# EAGLE schematic board (EAGLE 6.3)
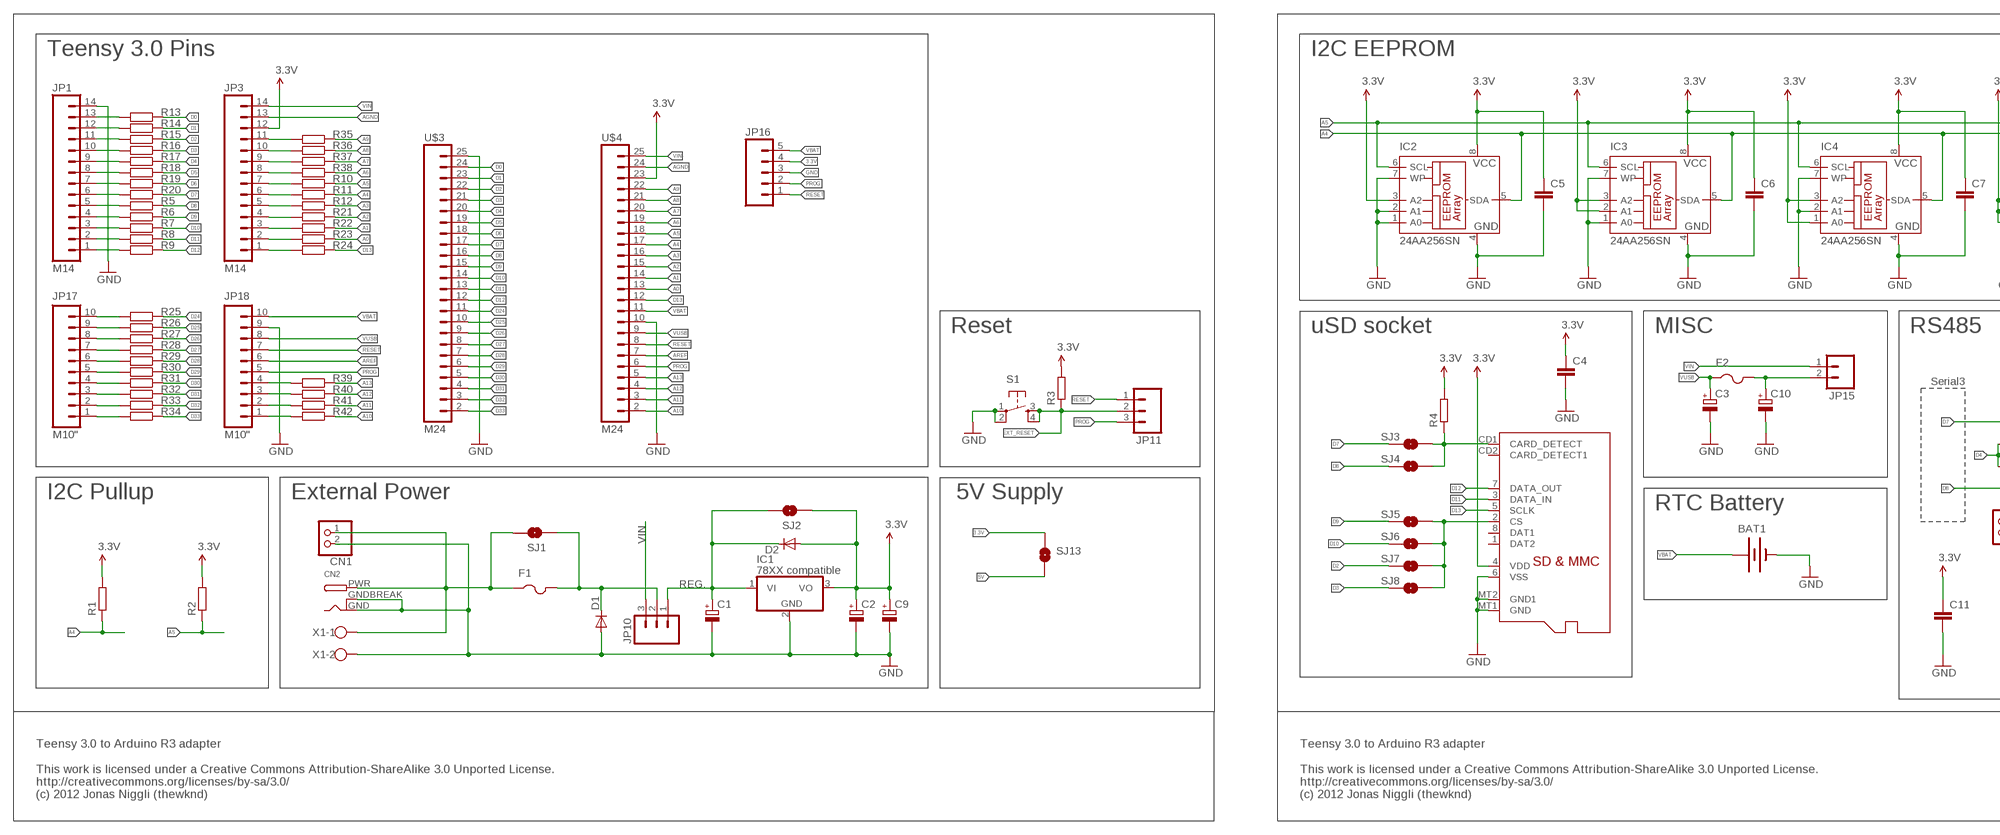
[diagram p0: schematic, sheet 1, part 1 of 2]
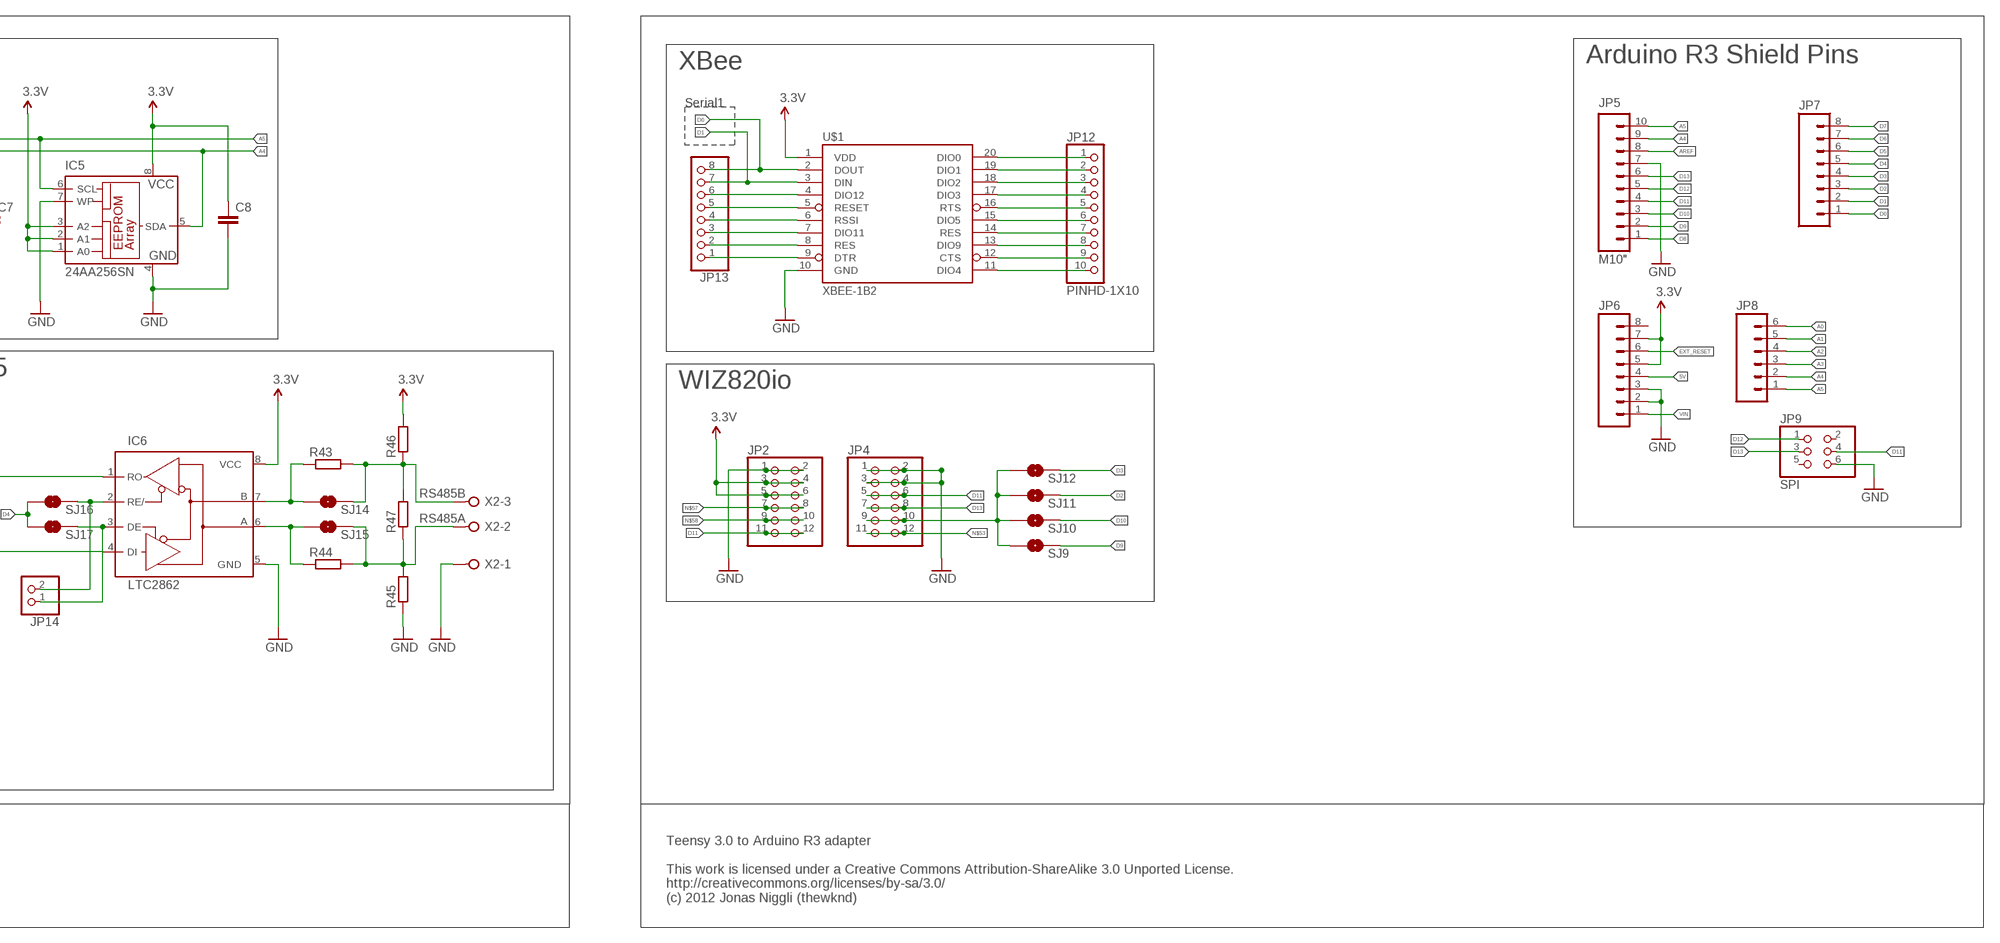
[diagram p1: schematic, sheet 1, part 2 of 2]

## Parts
BAT1  BATTERY12MM  [BATTCON_12MM]
C1  CPOL-EUCT3216  [CT3216]
C2  CPOL-EUCT3216  [CT3216]
C3  CPOL-EUCT3528  [CT3528]
C4  C-EUC0805K  [C0805K]
C5  C-EUC0805K  [C0805K]
C6  C-EUC0805K  [C0805K]
C7  C-EUC0805K  [C0805K]
C8  C-EUC0805K  [C0805K]
C9  CPOL-EUD  [PANASONIC_D]
C10  CPOL-EU085CS-1AR  [085CS_1AR]
C11  C-EUC0805K  [C0805K]
CN1  JST_2PIN-THM-RA  [JST-PH-2-THM-RA]
CN2  DCBARRELPTH  [DCJACK_2MM_PTH]
D1  DIODESMA-KIT  [SMA-DIODE-KIT]
D2  DIODESMA-KIT  [SMA-DIODE-KIT]
F1  PTCFUSE-1812  [1812]
F2  PTCFUSE-1812  [1812]
IC1  78XX compatible  7805TV  [TO220V]
IC2  24AA256SN  [SO-08]
IC3  24AA256SN  [SO-08]
IC4  24AA256SN  [SO-08]
IC5  24AA256SN  [SO-08]
IC6  LTC2862  MAX3468ESA  [SO08]
JP1  M14  [1X14]
JP2  PINHD-2X6  [2X06]
JP3  M14  [1X14]
JP4  PINHD-2X6  [2X06]
JP5  M10"  [1X10]
JP6  M081X08  [1X08]
JP7  M081X08  [1X08]
JP8  M06SIP  [1X06]
JP9  SPI  PINHD-2X3  [2X03]
JP10  M03PTH  [1X03]
JP11  M03PTH  [1X03]
JP12  PINHD-1X10  [1X10-BIG]
JP13  PINHD-1X8BIG  [1X08-BIG]
JP14  PINHD-1X2  [1X02]
JP15  M02PTH  [1X02]
JP16  M05PTH  [1X05]
JP17  M10"  [1X10]
JP18  M10"  [1X10]
R1  R-EU_R0805  [R0805]
R2  R-EU_R0805  [R0805]
R3  R-EU_R0805  [R0805]
R4  R-EU_R0805  [R0805]
R5  R-EU_R0805  [R0805]
R6  R-EU_R0805  [R0805]
R7  R-EU_R0805  [R0805]
R8  R-EU_R0805  [R0805]
R9  R-EU_R0805  [R0805]
R10  R-EU_R0805  [R0805]
R11  R-EU_R0805  [R0805]
R12  R-EU_R0805  [R0805]
R13  R-EU_R0805  [R0805]
R14  R-EU_R0805  [R0805]
R15  R-EU_R0805  [R0805]
R16  R-EU_R0805  [R0805]
R17  R-EU_R0805  [R0805]
R18  R-EU_R0805  [R0805]
R19  R-EU_R0805  [R0805]
R20  R-EU_R0805  [R0805]
R21  R-EU_R0805  [R0805]
R22  R-EU_R0805  [R0805]
R23  R-EU_R0805  [R0805]
R24  R-EU_R0805  [R0805]
R25  R-EU_R0805  [R0805]
R26  R-EU_R0805  [R0805]
R27  R-EU_R0805  [R0805]
R28  R-EU_R0805  [R0805]
R29  R-EU_R0805  [R0805]
R30  R-EU_R0805  [R0805]
R31  R-EU_R0805  [R0805]
R32  R-EU_R0805  [R0805]
R33  R-EU_R0805  [R0805]
R34  R-EU_R0805  [R0805]
R35  R-EU_R0805  [R0805]
R36  R-EU_R0805  [R0805]
R37  R-EU_R0805  [R0805]
R38  R-EU_R0805  [R0805]
R39  R-EU_R0805  [R0805]
R40  R-EU_R0805  [R0805]
R41  R-EU_R0805  [R0805]
R42  R-EU_R0805  [R0805]
R43  R-EU_R0805  [R0805]
R44  R-EU_R0805  [R0805]
R45  R-EU_R0805  [R0805]
R46  R-EU_R0805  [R0805]
R47  R-EU_R0805  [R0805]
S1  TAC_SWITCHPTH  [TACTILE-PTH]
SJ1  SOLDERJUMPERNO  [SJ_2S-NO]
SJ2  SOLDERJUMPERNO  [SJ_2S-NO]
SJ3  SOLDERJUMPERNO  [SJ_2S-NO]
SJ4  SOLDERJUMPERNO  [SJ_2S-NO]
SJ5  SOLDERJUMPERNO  [SJ_2S-NO]
SJ6  SOLDERJUMPERNO  [SJ_2S-NO]
SJ7  SOLDERJUMPERNO  [SJ_2S-NO]
SJ8  SOLDERJUMPERNO  [SJ_2S-NO]
SJ9  SOLDERJUMPERNO  [SJ_2S-NO]
SJ10  SOLDERJUMPERNO  [SJ_2S-NO]
SJ11  SOLDERJUMPERNO  [SJ_2S-NO]
SJ12  SOLDERJUMPERNO  [SJ_2S-NO]
SJ13  SOLDERJUMPERNO  [SJ_2S-NO]
SJ14  SOLDERJUMPERNO  [SJ_2S-NO]
SJ15  SOLDERJUMPERNO  [SJ_2S-NO]
SJ16  SOLDERJUMPERNO  [SJ_2S-NO]
SJ17  SOLDERJUMPERNO  [SJ_2S-NO]
U1  MICROSD  [MICROSD]
U$1  XBEE-1B2  [XBEE-SILK]
U$3  M24  [1X24]
U$4  M24  [1X24]
X1  W237-102  [W237-102]
X2  W237-03P  [W237-133]

## Nets
3.3V [POWER]: C2.+ C4.1 C5.1 C6.1 C7.1 C8.1 C9.+ C11.1 D2.A IC1.3(VO) IC2.3(A2) IC2.8(VCC) IC3.2(A1) IC3.3(A2) IC3.8(VCC) IC4.1(A0) IC4.3(A2) IC4.8(VCC) IC5.1(A0) IC5.2(A1) IC5.3(A2) IC5.8(VCC) IC6.8(VCC) JP2.3 JP2.4 JP2.5 JP2.6 JP3.12 JP6.5 JP6.7 JP16.4 R1.2 R2.2 R3.2 R4.2 R46.2 SJ2.1 SJ13.1 U1.4(VDD) U$1.1(VDD) U$4.23
5V [POWER]: JP6.4 SJ13.2
A0: JP8.6 R23.1 U$4.13
A1: JP8.5 R22.1 U$4.14
A2: JP8.4 R21.1 U$4.15
A3: JP8.3 R12.1 U$4.16
A4: IC2.5(SDA) IC3.5(SDA) IC4.5(SDA) IC5.5(SDA) JP5.9 JP8.2 R1.1 R11.1 U$4.17
A5: IC2.6(SCL) IC3.6(SCL) IC4.6(SCL) IC5.6(SCL) JP5.10 JP8.1 R2.1 R10.1 U$4.18
A6: R38.1 U$4.19
A7: R37.1 U$4.20
A8: R36.1 U$4.21
A9: R35.1 U$4.22
A10: R42.1 U$4.2
A11: R41.1 U$4.3
A12: R40.1 U$4.4
A13: R39.1 U$4.5
AGND [POWER]: JP3.13 U$4.24
AREF: JP5.8 JP18.6 U$4.7
D0: JP7.1 JP13.8 R13.1 U$1.2(DOUT) U$3.24
D1: JP7.2 JP13.7 R14.1 U$1.3(DIN) U$3.23
D2: JP7.3 R15.1 SJ7.2 SJ11.2 U$3.22
D3: JP7.4 R16.1 SJ8.2 SJ12.2 U$3.21
D4: JP7.5 R17.1 SJ16.1 SJ17.1 U$3.20
D5: JP7.6 R18.1 U$3.19
D6: JP7.7 R19.1 U$3.18
D7: IC6.1(RO) JP7.8 R20.1 SJ3.2 U$3.17
D8: IC6.4(DI) JP5.1 R5.1 SJ4.2 U$3.16
D9: JP5.2 R6.1 SJ5.2 SJ9.2 U$3.15
D10: JP5.3 R7.1 SJ6.2 SJ10.2 U$3.14
D11: JP2.11 JP2.12 JP4.5 JP4.6 JP5.4 JP9.4 R8.1 U1.3(DATA_IN) U$3.13
D12: JP5.5 JP9.1 R9.1 U1.7(DATA_OUT) U$3.12
D13: JP4.7 JP4.8 JP5.6 JP9.3 R24.1 U1.5(SCLK) U$4.12
D24: R25.1 U$3.11
D25: R26.1 U$3.10
D26: R27.1 U$3.9
D27: R28.1 U$3.8
D28: R29.1 U$3.7
D29: R30.1 U$3.6
D30: R31.1 U$3.5
D31: R32.1 U$3.4
D32: R33.1 U$3.3
D33: R34.1 U$3.2
EXT_POWER [POWER]: CN1.1 CN2.PWR F1.1 SJ1.2 X1.1
EXT_RESET: JP6.6 JP11.2 R3.1 S1.3 S1.4
GND [POWER]: BAT1.GND(-) C1.- C2.- C3.- C4.2 C5.2 C6.2 C7.2 C8.2 C9.- C10.- C11.2 CN1.2 CN2.GND CN2.GNDBREAK D1.A IC1.2(GND) IC2.1(A0) IC2.2(A1) IC2.4(GND) IC2.7(WP) IC3.1(A0) IC3.4(GND) IC3.7(WP) IC4.2(A1) IC4.4(GND) IC4.7(WP) IC5.4(GND) IC5.7(WP) IC6.5(GND) JP1.14 JP2.1 JP2.2 JP4.1 JP4.2 JP4.3 JP4.4 JP5.7 JP6.2 JP6.3 JP9.6 JP16.3 JP18.9 R45.1 S1.1 S1.2 U1.6(VSS) U1.MT1(GND) U1.MT2(GND1) U$1.10(GND) U$3.25 U$4.10 X1.2 X2.1
N$1 [POWER]: D1.C F1.2 JP10.2 SJ1.1
N$2 [POWER]: C10.+ F2.2 JP15.2
N$3 [POWER]: C1.+ D2.C IC1.1(VI) JP10.1 SJ2.2
N$5: JP1.5 R5.2
N$6: JP1.4 R6.2
N$7: JP1.3 R7.2
N$8: JP1.2 R8.2
N$9: JP1.1 R9.2
N$10: JP3.7 R10.2
N$11: JP3.6 R11.2
N$12: JP3.5 R12.2
N$13: JP1.13 R13.2
N$14: JP1.12 R14.2
N$15: JP1.11 R15.2
N$16: JP1.10 R16.2
N$17: JP1.9 R17.2
N$18: JP1.8 R18.2
N$19: JP1.7 R19.2
N$20: JP1.6 R20.2
N$21: JP3.4 R21.2
N$22: JP3.3 R22.2
N$23: JP3.2 R23.2
N$24: JP3.1 R24.2
N$25: JP17.10 R25.2
N$26: JP17.9 R26.2
N$27: JP17.8 R27.2
N$28: JP17.7 R28.2
N$29: JP17.6 R29.2
N$30: JP17.5 R30.2
N$31: JP17.4 R31.2
N$32: JP17.3 R32.2
N$33: JP17.2 R33.2
N$34: JP17.1 R34.2
N$35: JP3.11 R35.2
N$36: JP3.10 R36.2
N$37: JP3.9 R37.2
N$38: JP3.8 R38.2
N$39: JP18.4 R39.2
N$40: JP18.3 R40.2
N$41: JP18.2 R41.2
N$42: JP18.1 R42.2
N$43: IC6.2(RE/) JP14.2 SJ16.2
N$44: IC6.3(DE) JP14.1 SJ17.2
N$45: JP13.6 U$1.4(DIO12)
N$46: JP13.5 U$1.5(RESET)
N$47: JP13.4 U$1.6(RSSI)
N$48: JP13.3 U$1.7(DIO11)
N$49: JP13.2 U$1.8(RES)
N$50: JP13.1 U$1.9(DTR)
N$51: JP12.1 U$1.20(DIO0)
N$52: JP4.9 JP4.10 SJ9.1 SJ10.1 SJ11.1 SJ12.1
N$53: JP4.11 JP4.12
N$54: JP12.2 U$1.19(DIO1)
N$55: JP12.3 U$1.18(DIO2)
N$56: JP12.4 U$1.17(DIO3)
N$57: JP2.7 JP2.8
N$58: JP2.9 JP2.10
N$59: JP12.5 U$1.16(RTS)
N$60: JP12.6 U$1.15(DIO5)
N$61: JP12.7 U$1.14(RES)
N$62: JP12.8 U$1.13(DIO9)
N$63: JP12.9 U$1.12(CTS)
N$64: JP12.10 U$1.11(DIO4)
N$65: IC6.7(B) R43.1 SJ14.1
N$66: IC6.6(A) R44.1 SJ15.1
NIC: R4.1 SJ3.1 SJ4.1 U1.CD1(CARD_DETECT)
PROG: JP11.3 JP16.2 JP18.5 U$4.6
QW: SJ5.1 SJ6.1 SJ7.1 SJ8.1 U1.2(CS)
RESET: JP11.1 JP16.1 JP18.7 U$4.8
RS485A: R44.2 R45.2 R47.1 SJ15.2 X2.2
RS485B: R43.2 R46.1 R47.2 SJ14.2 X2.3
VBAT: BAT1.PWR@1(+) JP16.5 JP18.10 U$4.11
VIN [POWER]: JP3.14 JP6.1 JP10.3 JP15.1 U$4.25
VUSB [POWER]: C3.+ F2.1 JP18.8 U$4.9
Unconnected: JP6.8 JP9.2 JP9.5 U1.1(DAT2) U1.8(DAT1) U1.CD2(CARD_DETECT1)

## Notes on the sheet
- Teensy 3.0 Pins | I2C EEPROM | XBee | Arduino R3 Shield Pins
- Serial1
- Reset | uSD socket | MISC | RS485
- WIZ820io
- Serial3
- RS485B
- RS485A
- I2C Pullup | External Power | 5V Supply
- RTC Battery
- REG.
- Teensy 3.0 to Arduino R3 adapter
  
  This work is licensed under a Creative Commons Attribution-ShareAlike 3.0 Unported License.
  http://creativecommons.org/licenses/by-sa/3.0/
  (c) 2012 Jonas Niggli (thewknd)
- Teensy 3.0 to Arduino R3 adapter
  
  This work is licensed under a Creative Commons Attribution-ShareAlike 3.0 Unported License.
  http://creativecommons.org/licenses/by-sa/3.0/
  (c) 2012 Jonas Niggli (thewknd)
- Teensy 3.0 to Arduino R3 adapter
  
  This work is licensed under a Creative Commons Attribution-ShareAlike 3.0 Unported License.
  http://creativecommons.org/licenses/by-sa/3.0/
  (c) 2012 Jonas Niggli (thewknd)

## Library data of the parts
BAT1 = SparkFun-Electromechanical:BATTERY: Battery Holders Various common sizes : AA, AAA, 20mm coin cell and 12mm coin cell.
C1 C2 C9 = resistor:CPOL-EU: POLARIZED CAPACITOR, European symbol
C3 C10 = rcl:CPOL-EU: POLARIZED CAPACITOR, European symbol
C4-C8 C11 = rcl:C-EU: CAPACITOR, European symbol
CN1 = adafruit:JST_2PIN: JST 2-Pin Connectors of various flavors SMT-RA (S2B-PH-SM4) 4UConnector #17311 SMT (B2B-PH-SM4) THM-RA (S2B-PH) THM (B2B-PH)
CN2 = adafruit:DCBARREL: 2.0mm DC Barrel Jack DCJACK_2MM_PTH - Through Hole Jack (4UConnector: 05537)
D1 D2 = SparkFun-DiscreteSemi:DIODE: Diode These are standard reverse protection diodes and small signal diodes. SMA package can handle up to about 1A. SOD-323 can handle about 200mA. What the SOD-323 package when ordering, there are some mfgs out there that are 5-pin packages.
F1 F2 = adafruit:PTCFUSE: PTC fuses, resettable thermistors
IC1 = linear:78*: Positive VOLTAGE REGULATOR Source: http://cache.national.com/ds/LM/LM78L05.pdf http://www.fairchildsemi.com/ds/LM/LM7805.pdf
IC2-IC5 = microchip:24*: Serial EEPROM I2C; MPN: 24AA256T-I/SM; OC_FARNELL: 1579570; OC_NEWARK: 08N6838
IC6 = maxim:MAX34*: +5V, Fail-Safe, 40Mbps, Profibus RS-485/RS-422 Transceivers Source: MAX3465-MAX3469.pdf; MPN: MAX3468ESA+T; OC_FARNELL: unknown; OC_NEWARK: 76K6724
JP1 JP3 = SparkFun-Connectors:M14: Header 14 Standard 14-pin 0.1" header. Use with straight break away headers (SKU : PRT-00116), right angle break away headers (PRT-00553), swiss pins (PRT-00743), machine pins (PRT-00117), and female headers (PRT-00115).
JP2 JP4 = pinhead:PINHD-2X6: PIN HEADER
JP5 JP17 JP18 = SparkFun-Connectors:M10: Header 10 Standard 10-pin 0.1" header. Use with straight break away headers (SKU : PRT-00116), right angle break away headers (PRT-00553), swiss pins (PRT-00743), machine pins (PRT-00117), and female headers (PRT-00115).
JP6 JP7 = SparkFun-Connectors:M08: Header 8 Standard 8-pin 0.1" header. Use with straight break away headers (SKU : PRT-00116), right angle break away headers (PRT-00553), swiss pins (PRT-00743), machine pins (PRT-00117), and female headers (PRT-00115).
JP8 = SparkFun-Connectors:M06: Header 6 Standard 6-pin 0.1" header. Use with straight break away headers (SKU : PRT-00116), right angle break away headers (PRT-00553), swiss pins (PRT-00743), machine pins (PRT-00117), and female headers (PRT-00115). Molex polarized connector foot print use with SKU : PRT-08094 with associated crimp pins and housings. NOTES ON THE VARIANTS LOCK and LOCK_LONGPADS... This footprint was designed to help hold the alignment of a through-hole component (i.e. 6-pin header) while soldering it into place. You may notice that each hole has been shifted either up or down by 0.005 of an inch from it's more standard position (which is a perfectly straight line). This slight alteration caused the pins (the squares in the middle) to touch the edges of the holes. Because they are alternating, it causes a "brace" to hold the component in place. 0.005 has proven to be the perfect amount of "off-center" position when using our standard breakaway headers. Although looks a little odd when you look at the bare footprint, once you have a header in there, the alteration is very hard to notice. Also, if you push a header all the way into place, it is covered up entirely on the bottom side. This idea of altering the position of holes to aid alignment will be further integrated into the Sparkfun Library for other footprints. It can help hold any component with 3 or more connection pins.
JP9 = SparkFun-Connectors:PINHD-2X3: PIN HEADER
JP10 JP11 = SparkFun-Connectors:M03: Header 3 Standard 3-pin 0.1" header. Use with straight break away headers (SKU : PRT-00116), right angle break away headers (PRT-00553), swiss pins (PRT-00743), machine pins (PRT-00117), and female headers (PRT-00115). Molex polarized connector foot print use with SKU : PRT-08232 with associated crimp pins and housings.
JP12 = adafruit:PINHD-1X10: Pin header 1x10 0.1" spacing With round pins
JP13 = adafruit:PINHD-1X8: PIN HEADER
JP14 = pinhead:PINHD-1X2: PIN HEADER
JP15 = SparkFun-Connectors:M02: Header 2 Standard 2-pin 0.1" header. Use with straight break away headers (SKU : PRT-00116), right angle break away headers (PRT-00553), swiss pins (PRT-00743), machine pins (PRT-00117), and female headers (PRT-00115). Molex polarized connector foot print use with SKU : PRT-08233 with associated crimp pins and housings.
JP16 = SparkFun-Connectors:M05: Header 5 Standard 5-pin 0.1" header. Use with straight break away headers (SKU : PRT-00116), right angle break away headers (PRT-00553), swiss pins (PRT-00743), machine pins (PRT-00117), and female headers (PRT-00115). Molex polarized connector foot print use with SKU : PRT-08230 with associated crimp pins and housings.
R1-R47 = resistor:R-EU_: RESISTOR, European symbol
S1 = SparkFun-Electromechanical:TAC_SWITCH: Momentary Switch Button commonly used for reset or general input. Spark Fun Electronics SKU : COM-00097
SJ1-SJ17 = SparkFun-Passives:SOLDERJUMPER: Solder Jumper Standard SMD solder jumper. Used to automate production. Two varients : Normally Open and Normally Closed are the same, but have different paste layers. NC will have a large amount of paste and should jumper during reflow.
U1 = adafruit:MICROSD: Micro-SD / Transflash card holder with SPI pinout For the 3M # 2908-05WB-MG and/or 4UCON #19656 push-push type
U$1 = SparkFun-RF:XBEE-1: Xbee module footprints
U$3 U$4 = SparkFun-Connectors:M24: 1x24 .1" header
X1 = con-wago-500:W237-102: WAGO SCREW CLAMP; MPN: 237-102; OC_FARNELL: unknown; OC_NEWARK: 70K9898
X2 = con-wago-508:W237-03P: WAGO SREW CLAMP; OC_FARNELL: unknown; OC_NEWARK: unknown

## Net classes
0 default: width 0.254 mm, drill 0.356 mm, clearance 0.203 mm
1 POWER: width 0.508 mm, drill 0.559 mm, clearance 0.254 mm